# Altium schematic sheet LED 7 THANH.SchDoc
size A3; SheetNumber: 2; SheetTotal: 5
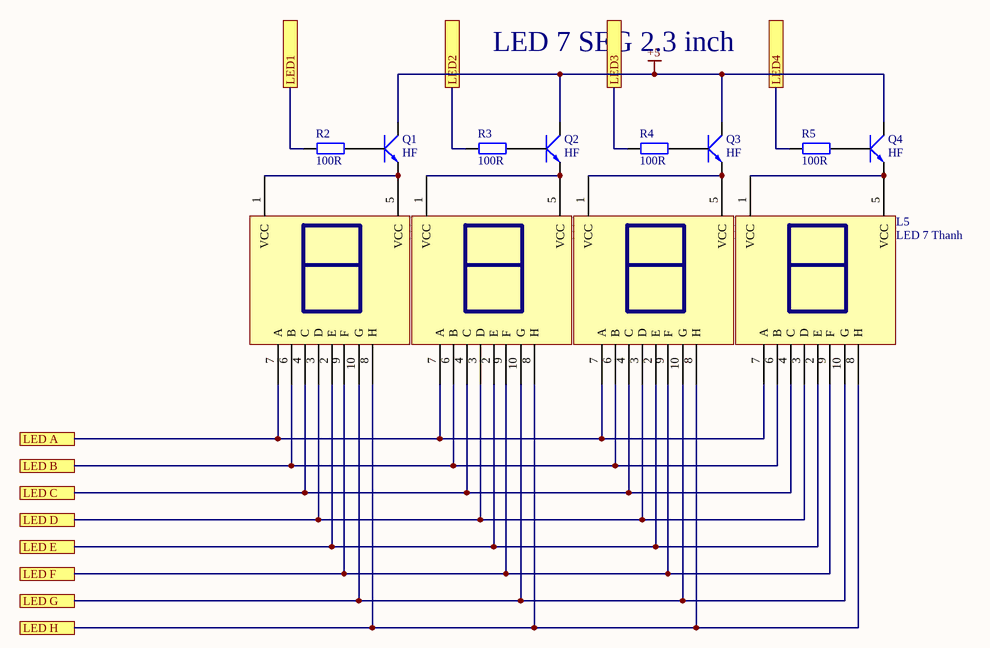
[diagram p0: LED 7 THANH.SchDoc]

## Parts
L2  LED 7 Thanh  [LED7SEG_2.3inch]
L3  LED 7 Thanh  [LED7SEG_2.3inch]
L4  LED 7 Thanh  [LED7SEG_2.3inch]
L5  LED 7 Thanh  [LED7SEG_2.3inch]
Q1  HF  [SOT23]
Q2  HF  [SOT23]
Q3  HF  [SOT23]
Q4  HF  [SOT23]
R2  100R  [tro smd 0805]
R3  100R  [tro smd 0805]
R4  100R  [tro smd 0805]
R5  100R  [tro smd 0805]

## Ports
LED1, LED2, LED3, LED4, LED A, LED B, LED C, LED D, LED E, LED F, LED G, LED H

## Nets
+5: Q1.3(C) Q2.3(C) Q3.3(C) Q4.3(C)
LED1: R2.1 ; port LED1
LED2: R3.1 ; port LED2
LED3: R4.1 ; port LED3
LED4: R5.1 ; port LED4
LED A: L2.7(A) L3.7(A) L4.7(A) L5.7(A) ; port LED A
LED B: L2.6(B) L3.6(B) L4.6(B) L5.6(B) ; port LED B
LED C: L2.4(C) L3.4(C) L4.4(C) L5.4(C) ; port LED C
LED D: L2.3(D) L3.3(D) L4.3(D) L5.3(D) ; port LED D
LED E: L2.2(E) L3.2(E) L4.2(E) L5.2(E) ; port LED E
LED F: L2.9(F) L3.9(F) L4.9(F) L5.9(F) ; port LED F
LED G: L2.10(G) L3.10(G) L4.10(G) L5.10(G) ; port LED G
LED H: L2.8(H) L3.8(H) L4.8(H) L5.8(H) ; port LED H
NetL2_1: L2.1(VCC) L2.5(VCC) Q1.2(E)
NetL3_1: L3.1(VCC) L3.5(VCC) Q2.2(E)
NetL4_1: L4.1(VCC) L4.5(VCC) Q3.2(E)
NetL5_1: L5.1(VCC) L5.5(VCC) Q4.2(E)
NetQ1_1: Q1.1(B) R2.2
NetQ2_1: Q2.1(B) R3.2
NetQ3_1: Q3.1(B) R4.2
NetQ4_1: Q4.1(B) R5.2

## Notes on the sheet
- LED 7 SEG 2.3 inch

## Library data of the parts
L2-L5 = LED 7x1 2.3inch Anot: Dán; Don_Vi: Con; Ma_Hang: MH000901; Ten_Linh_Kien: Led 7 2.3 1 Số Anot (Sáng Đỏ); Ghi_Chu: *; Kieu_Chan: *; Chung_Loai: Dán
Q1-Q4 = C1815 HF SMD: NPN transistor; Value: C9014
R2-R5 = Tro 0805 5% 100R: Dán; Don_Vi: Con; So_Chan: 2; Ten_Linh_Kien: Trở 0805 5% 100R; Ma_Hang: MH005251; Chung_Loai: Dán; Kieu_Chan: *